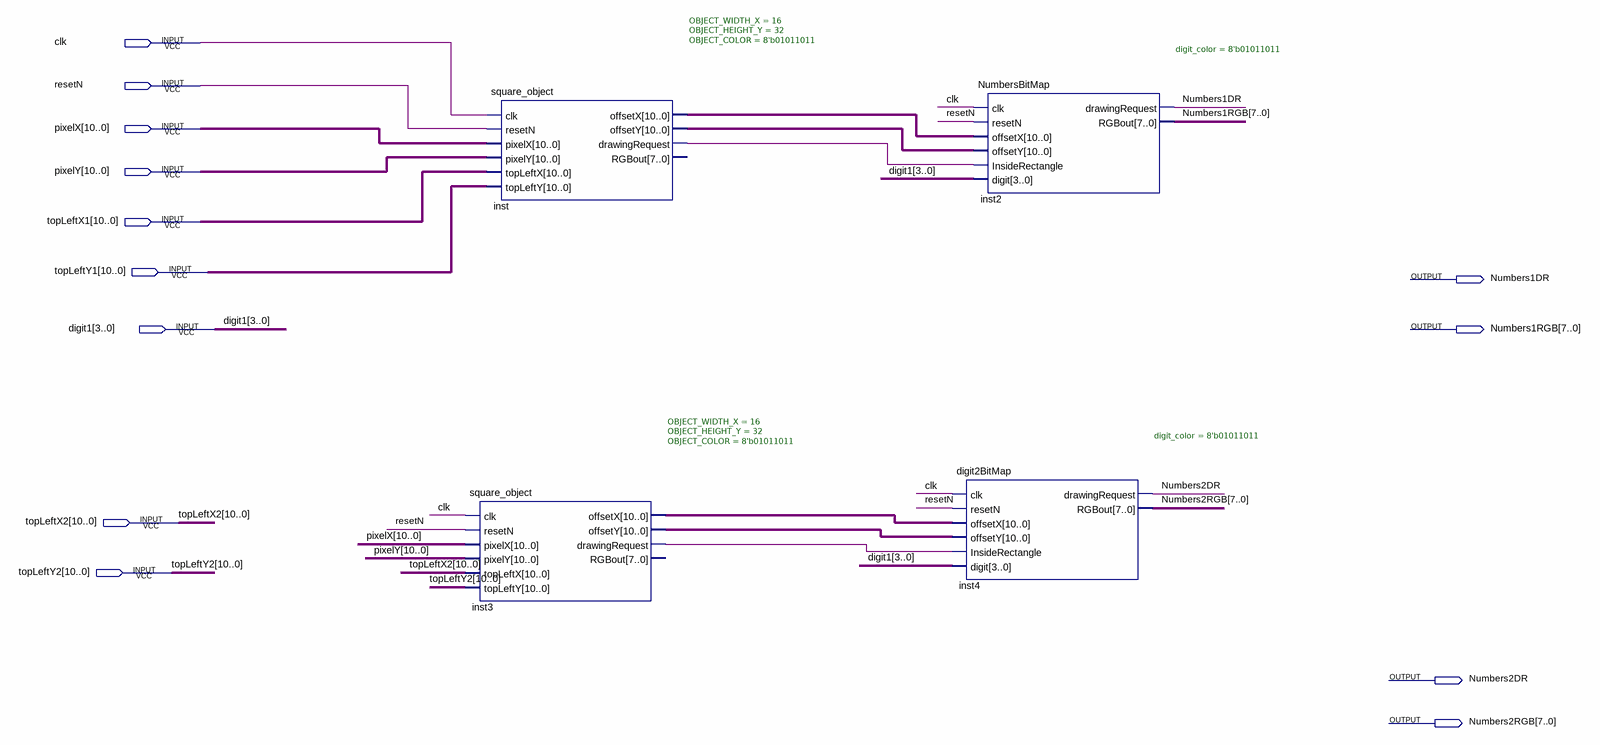
[diagram p0: schematic sheet]
// Quartus schematic 2NumbersBlock.bdf as structural Verilog: 4 symbols, 13 pins
module \2NumbersBlock  (
  input  clk,
  input  resetN,
  input  [10:0] pixelX,
  input  [10:0] pixelY,
  input  [10:0] topLeftX1,
  input  [10:0] topLeftY1,
  input  [3:0] digit1,
  input  [10:0] topLeftX2,
  input  [10:0] topLeftY2,
  output Numbers1DR,
  output [7:0] Numbers1RGB,
  output Numbers2DR,
  output [7:0] Numbers2RGB
);

  wire inst3_drawingrequest, inst_drawingrequest;
  wire [10:0] inst3_offsetx, inst3_offsety, inst_offsetx, inst_offsety;

  square_object #(.OBJECT_WIDTH_X(16), .OBJECT_HEIGHT_Y(32), .OBJECT_COLOR(8'b01011011)) inst3 (
    .clk(clk), .resetN(resetN), .pixelX(pixelX), .pixelY(pixelY), .topLeftX(topLeftX2), .topLeftY(topLeftY2),
    .offsetX(inst3_offsetx), .offsetY(inst3_offsety), .drawingRequest(inst3_drawingrequest));  // open: RGBout
  square_object #(.OBJECT_WIDTH_X(16), .OBJECT_HEIGHT_Y(32), .OBJECT_COLOR(8'b01011011)) inst (
    .clk(clk), .resetN(resetN), .pixelX(pixelX), .pixelY(pixelY), .topLeftX(topLeftX1), .topLeftY(topLeftY1),
    .offsetX(inst_offsetx), .offsetY(inst_offsety), .drawingRequest(inst_drawingrequest));  // open: RGBout
  NumbersBitMap #(.digit_color(8'b01011011)) inst2 (
    .clk(clk), .resetN(resetN), .offsetX(inst_offsetx), .offsetY(inst_offsety),
    .InsideRectangle(inst_drawingrequest), .digit(digit1), .drawingRequest(Numbers1DR), .RGBout(Numbers1RGB));
  digit2BitMap #(.digit_color(8'b01011011)) inst4 (
    .clk(clk), .resetN(resetN), .offsetX(inst3_offsetx), .offsetY(inst3_offsety),
    .InsideRectangle(inst3_drawingrequest), .digit(digit1), .drawingRequest(Numbers2DR), .RGBout(Numbers2RGB));
endmodule
